# EAGLE design RingLight (EAGLE 7.1.0)
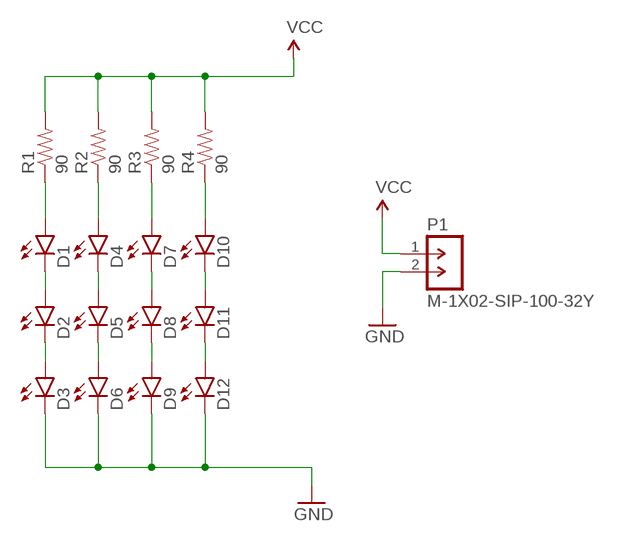
[diagram p0: schematic, sheet 1]

## Parts
D1  LED1206  [LED-1206]
D2  LED1206  [LED-1206]
D3  LED1206  [LED-1206]
D4  LED1206  [LED-1206]
D5  LED1206  [LED-1206]
D6  LED1206  [LED-1206]
D7  LED1206  [LED-1206]
D8  LED1206  [LED-1206]
D9  LED1206  [LED-1206]
D10  LED1206  [LED-1206]
D11  LED1206  [LED-1206]
D12  LED1206  [LED-1206]
P1  M-1X02-SIP-100-32Y  [SIP-100-02-32Y]
R1  90  RESISTOR1206  [1206]
R2  90  RESISTOR1206  [1206]
R3  90  RESISTOR1206  [1206]
R4  90  RESISTOR1206  [1206]

## Nets
GND: D3.C D6.C D9.C D12.C P1.2
N$1: D1.A R1.1
N$2: D4.A R2.1
N$3: D7.A R3.1
N$4: D10.A R4.1
N$5: D1.C D2.A
N$6: D4.C D5.A
N$7: D7.C D8.A
N$8: D10.C D11.A
N$9: D11.C D12.A
N$10: D8.C D9.A
N$11: D5.C D6.A
N$12: D2.C D3.A
VCC: P1.1 R1.2 R2.2 R3.2 R4.2

## Library data of the parts
D1-D12 = SparkFun-LED:LED: LEDs Standard schematic elements and footprints for 5mm, 3mm, 1206, and 0603 sized LEDs. 5mm - Spark Fun Electronics SKU : COM-00529 (and others)
P1 = con-headers-jp:M-1X02-: MALE HEADER
R1-R4 = SparkFun-Passives:RESISTOR: Resistor Basic schematic elements and footprints for 0603, 1206, and PTH resistors.

## Board
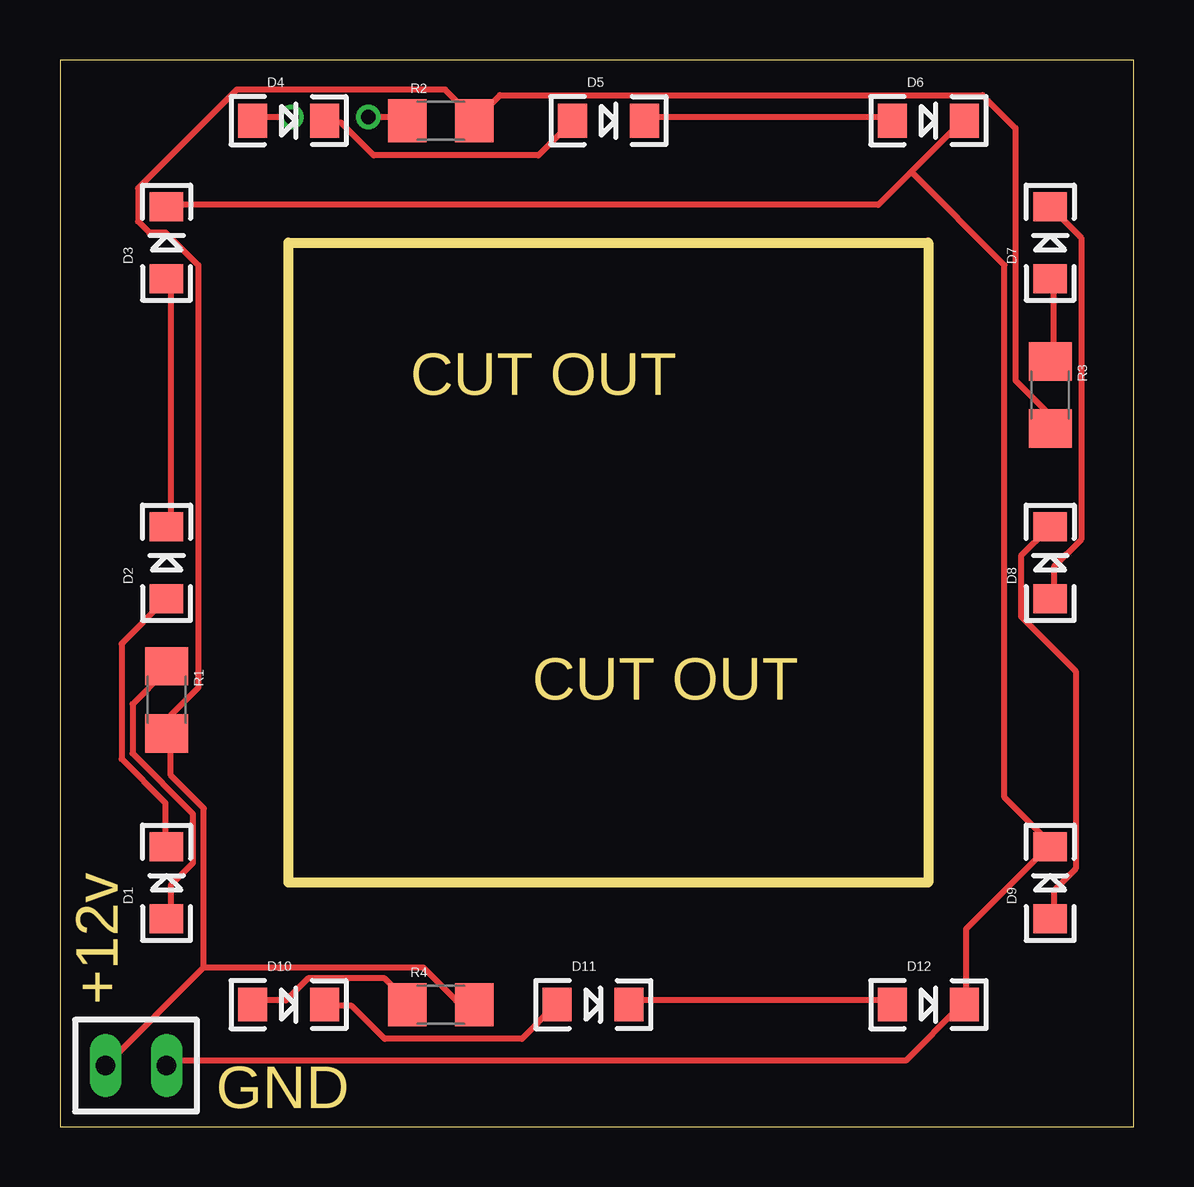
[diagram p1: board, top side]
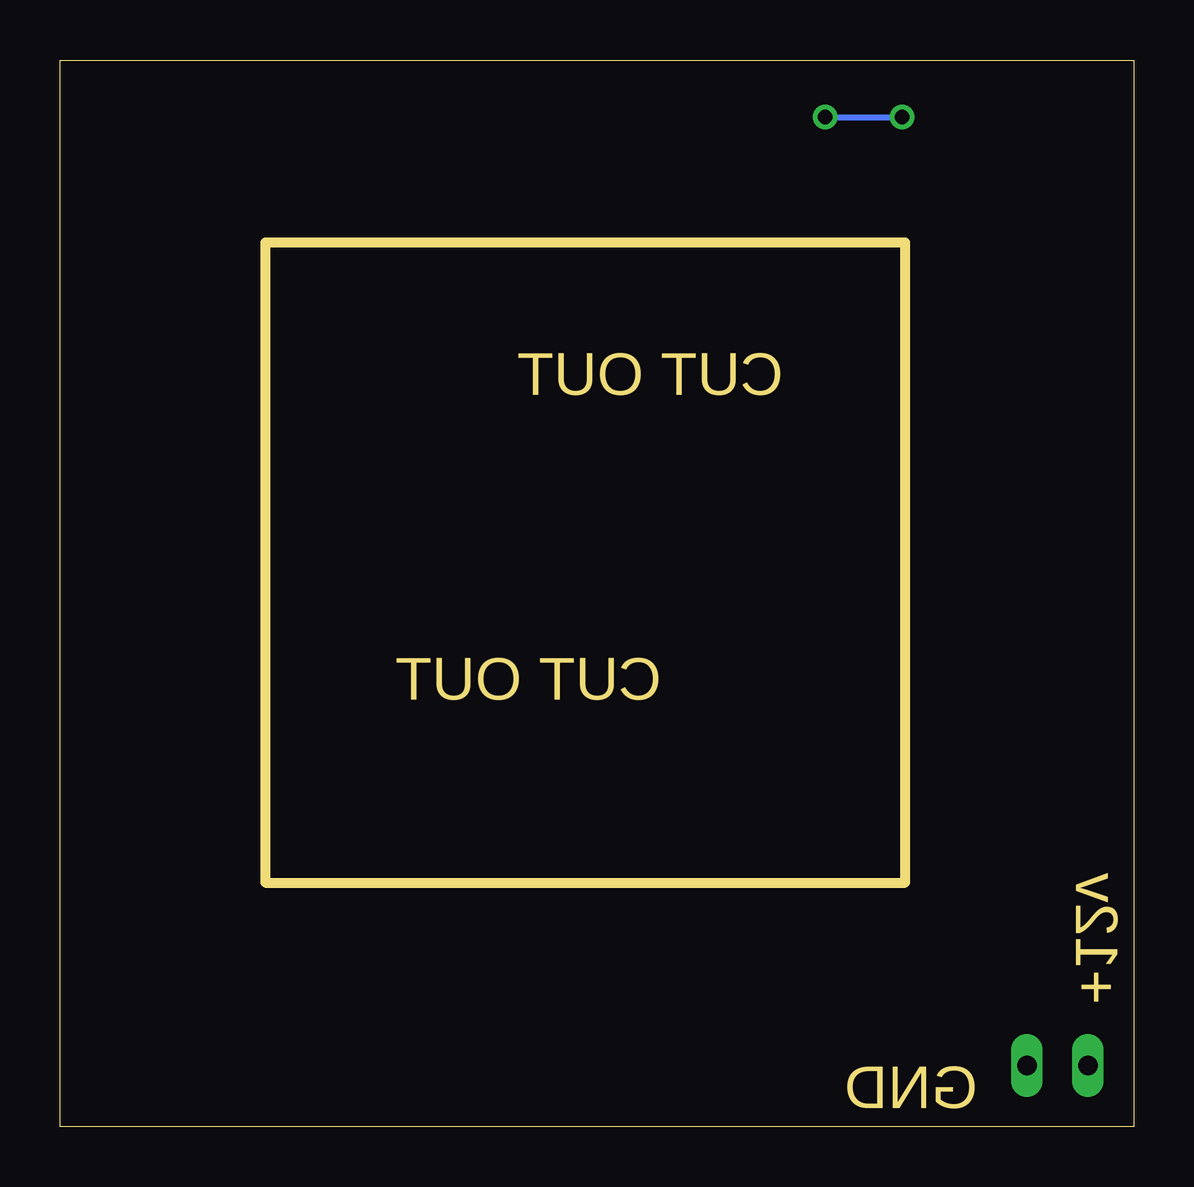
[diagram p2: board, bottom side, seen from below]

Size 44.76 x 44.44 mm. Coordinates in mm from the lower left corner, seen from the top.
Outline: 0,0 44.76,0 44.76,44.44 0,44.44 0,0
Outline: 9.53,36.83 36.2,36.83 36.2,10.16 9.53,10.16 9.53,36.83
Copper layers (1*16): Top 0.035mm / dielectric 1.5mm / Bottom 0.035mm
Design rules "default": minimum track width 10mil, minimum drill 24mil, track to track 8mil, track to pad 8mil, pad to pad 8mil, via to via 8mil, smd to smd 8mil, copper to edge 40mil, drill to drill 8mil, minimum pad ring 10mil, minimum via ring 8mil, stop-mask expansion 4mil, vias tented up to drill 0mil, thermal gap 10mil

### Footprints (pad centres in the part's own frame; a part is rotated, then mirrored left to right if it is on the bottom)
LED-1206 = smd 1.2 x 1.4: A -1.5,0; C 1.5,0
SIP-100-02-32Y = drill 0.813 long: 1 -1.27,0; 2 1.27,0
1206 = smd 1.6 x 1.8: 1 -1.4,0; 2 1.4,0

### Placement (x,y rotation side)
D1  4.45,10.16 90 top
D2  4.45,23.5 90 top
D3  4.45,36.83 90 top
D4  9.53,41.91 0 top
D5  22.86,41.91 0 top
D6  36.2,41.91 0 top
D7  41.27,36.83 90 top
D8  41.27,23.5 90 top
D9  41.27,10.16 90 top
D10  9.53,5.08 0 top
D11  22.22,5.08 0 top
D12  36.2,5.08 0 top
P1  3.17,2.54 0 top
R1  4.45,17.78 270 top
R2  15.88,41.91 0 top
R3  41.27,30.48 270 top
R4  15.88,5.08 0 top

### Tracks (layer width: path | path; a pad name or v marks a point on that pad's centre or on a via)
GND
  Top 0.254: 35.48,39.78 37.54,41.83 D6.C | 35.48,39.78 34.11,38.41 4.62,38.41 D3.C | P1.2 4.62,2.74 35.26,2.74 37.54,5.03 D12.C 37.77,5.26 37.77,8.23 41.2,11.66 D9.C 41.2,11.89 39.37,13.72 39.37,35.89 35.48,39.78
N$1
  Top 0.254: D1.A 4.62,8.69 4.62,10.06 5.54,10.97 5.54,13.03 3.02,15.54 3.02,17.6 4.39,18.97 R1.1
N$2  (via drill 0.61)
  Top 0.254: v9.65,42.06 8.05,42.06 D4.A | v12.85,42.06 14.45,42.06 R2.1
  Bottom 0.254: v12.85,42.06 v9.65,42.06
N$3
  Top 0.254: D7.A 41.43,35.2 41.43,32 R3.1
N$4
  Top 0.254: D10.A 8.05,5.26 9.42,5.26 10.34,6.17 13.54,6.17 14.45,5.26 R4.1
N$5
  Top 0.254: D1.C 4.39,11.89 4.39,13.49 2.57,15.32 2.57,20.12 4.39,21.95 D2.A
N$6
  Top 0.254: D4.C 11.25,41.83 11.71,41.83 13.08,40.46 19.94,40.46 21.31,41.83 D5.A
N$7
  Top 0.254: D8.A 41.43,22.17 41.43,23.32 42.57,24.46 42.57,37.03 41.43,38.18 D7.C
N$8
  Top 0.254: D10.C 11.25,5.03 12.17,5.03 13.54,3.66 19.25,3.66 20.62,5.03 D11.A
N$9
  Top 0.254: D11.C 23.82,5.26 34.57,5.26 D12.A
N$10
  Top 0.254: D9.A 41.43,8.69 41.43,9.83 42.34,10.74 42.34,18.97 40.06,21.26 40.06,23.77 41.2,24.92 D8.C
N$11
  Top 0.254: D5.C 24.51,42.06 34.57,42.06 D6.A
N$12
  Top 0.254: D2.C 4.62,25.15 4.62,35.2 D3.A
VCC
  Top 0.254: 5.99,6.63 15.14,6.63 16.51,5.26 17.2,5.26 R4.2 | P1.1 5.99,6.63 | 5.99,6.63 5.99,13.26 4.62,14.63 4.62,16.23 R1.2 4.62,16.46 4.62,17.14 5.77,18.29 5.77,35.89 4.39,37.26 3.71,37.26 3.25,37.72 3.25,39.09 7.37,43.2 16.05,43.2 17.2,42.06 R2.2 17.42,42.06 18.34,42.98 38.46,42.98 39.83,41.6 39.83,31.09 41.2,29.72 41.2,29.26 R3.2

### Text on the board
Dimension: CUT OUT | CUT OUT | +12v | GND